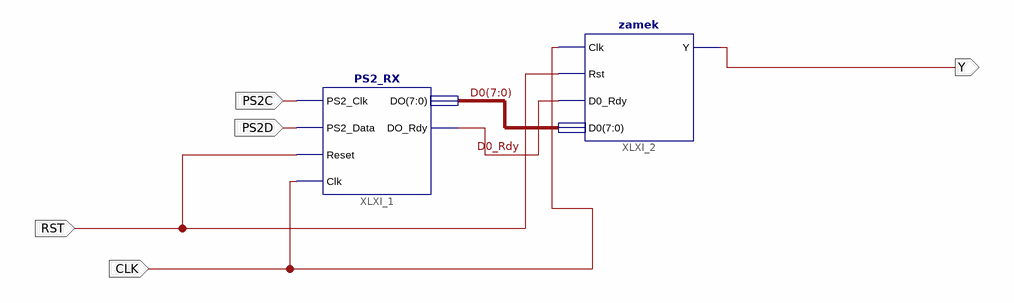
[diagram p0: schematic sheet 1]
// Xilinx ISE schematic schemat.sch (xc9500xl) as structural Verilog: 2 symbols, 5 ports
module schemat (
  input  RST,
  input  CLK,
  input  PS2D,
  input  PS2C,
  output Y
);

  wire D0_Rdy;
  wire [7:0] D0;

  PS2_RX XLXI_1 (.PS2_Clk(PS2C), .PS2_Data(PS2D), .Clk(CLK), .Reset(RST), .DO_Rdy(D0_Rdy), .DO(D0));
  zamek XLXI_2 (.Clk(CLK), .Rst(RST), .D0_Rdy(D0_Rdy), .D0(D0), .Y(Y));
endmodule
